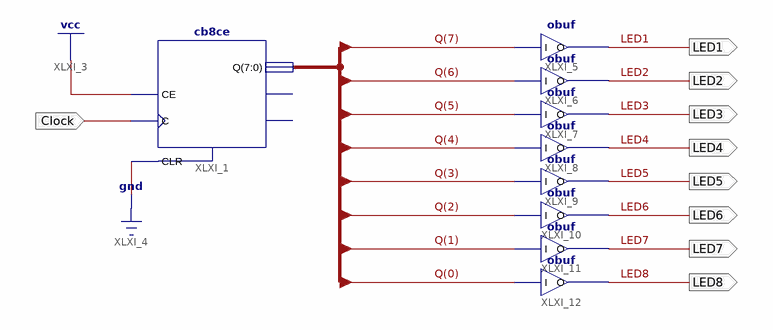
[diagram p0: schematic sheet 1]
// Xilinx ISE schematic T3.sch (spartan3) as structural Verilog: 9 symbols, 9 ports
module T3 (
  input  Clock,
  output LED1,
  output LED2,
  output LED3,
  output LED4,
  output LED5,
  output LED6,
  output LED7,
  output LED8
);

  wire [7:0] Q;

  cb8ce XLXI_1 (.C(Clock), .CE(1'b1), .CLR(1'b0), .Q(Q));  // open: CEO, TC
  obuf XLXI_5 (.I(Q[7]), .O(LED1));
  obuf XLXI_6 (.I(Q[6]), .O(LED2));
  obuf XLXI_7 (.I(Q[5]), .O(LED3));
  obuf XLXI_8 (.I(Q[4]), .O(LED4));
  obuf XLXI_9 (.I(Q[3]), .O(LED5));
  obuf XLXI_10 (.I(Q[2]), .O(LED6));
  obuf XLXI_11 (.I(Q[1]), .O(LED7));
  obuf XLXI_12 (.I(Q[0]), .O(LED8));
endmodule
